# Altium schematic sheet commu.SchDoc
size A4
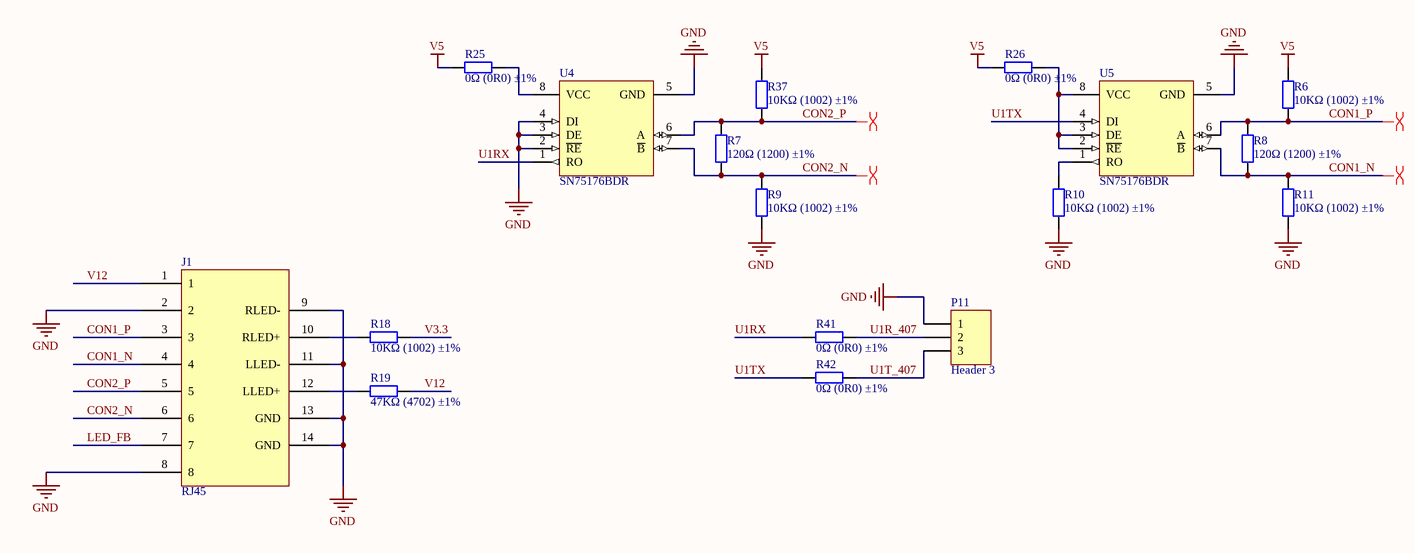
[diagram p0: commu.SchDoc]

## Parts
J1  RJ45  [RJ45_1]
P11  Header 3  [HDR1X3]
R6  10KΩ (1002) ±1%  [0603_R]
R7  120Ω (1200) ±1%  [0603_R]
R8  120Ω (1200) ±1%  [0603_R]
R9  10KΩ (1002) ±1%  [0603_R]
R10  10KΩ (1002) ±1%  [0603_R]
R11  10KΩ (1002) ±1%  [0603_R]
R18  10KΩ (1002) ±1%  [0603_R]
R19  47KΩ (4702) ±1%  [0603_R]
R25  0Ω (0R0) ±1%  [1206_R]
R26  0Ω (0R0) ±1%  [1206_R]
R37  10KΩ (1002) ±1%  [0603_R]
R41  0Ω (0R0) ±1%  [0603_R]
R42  0Ω (0R0) ±1%  [0603_R]
U4  SN75176BDR  [SOIC-8_150mil]
U5  SN75176BDR  [SOIC-8_150mil]

## Nets
GND: J1.2 J1.8 J1.9(RLED-) J1.11(LLED-) J1.13(GND) J1.14(GND) P11.1 R9.1 R10.1 R11.1 U4.2(~{RE}) U4.3(DE) U4.4(DI) U4.5(GND) U5.5(GND)
V5: R6.2 R25.1 R26.1 R37.2
CON1_N: J1.4 R8.1 R11.2 U5.7(~{B})
CON1_P: J1.3 R6.1 R8.2 U5.6(A)
CON2_N: J1.6 R7.1 R9.2 U4.7(~{B})
CON2_P: J1.5 R7.2 R37.1 U4.6(A)
LED_FB: J1.7
U1R_407: P11.2 R41.2
U1RX: R41.1 U4.1(RO)
U1T_407: P11.3 R42.2
U1TX: R42.1 U5.4(DI)
V3.3: R18.2
V12: J1.1 R19.2
NetJ1_10: J1.10(RLED+) R18.1
NetJ1_12: J1.12(LLED+) R19.1
NetR10_2: R10.2 U5.1(RO)
NetR25_2: R25.2 U4.8(VCC)
NetR26_2: R26.2 U5.2(~{RE}) U5.3(DE) U5.8(VCC)

## Layout directives
differential pair: CON1_N, CON1_P, CON2_N, CON2_P

## Library data of the parts
J1 = RJ45_1
P11 = Header 3: Header, 3-Pin; LatestRevisionDate: 17-Jul-2002; LatestRevisionNote: Re-released for DXP Platform.; Publisher: Altium Limited
R6 R9-R11 R18 R37 = 0603 10KΩ (1002) 1%: 贴片电阻; ComponentLink1Description: 供应商链接; ComponentLink1URL: http://www.szlcsc.com/product/details_26547.html; Package: 0603; Supplier: LC; SuppliersPartNumber: C25804
R7 R8 = 0603 120Ω (1200) 1%: 贴片电阻; ComponentLink1Description: 供应商链接; ComponentLink1URL: http://www.szlcsc.com/product/details_23514.html; Package: 0603; Supplier: LC; SuppliersPartNumber: C22787
R19 = 0603 47KΩ (4702) 1%: 贴片电阻; ComponentLink1Description: 供应商链接; ComponentLink1URL: http://www.szlcsc.com/product/details_26562.html; Package: 0603; Supplier: LC; SuppliersPartNumber: C25819
R25 R26 = 1206 0Ω (0R0) 1%: 贴片电阻; ComponentLink1Description: 供应商链接; ComponentLink1URL: http://www.szlcsc.com/product/details_18576.html; Package: 1206; Supplier: LC; SuppliersPartNumber: C17888
R41 R42 = 0603 0Ω (0R0) 1%: 贴片电阻; ComponentLink1Description: 供应商链接; ComponentLink1URL: http://www.szlcsc.com/product/details_21903.html; Package: 0603; Supplier: LC; SuppliersPartNumber: C21189
U4 U5 = SN75176BDR_[C7063]: RS-485/RS-422; ComponentLink1Description: 供应商链接; ComponentLink1URL: http://www.szlcsc.com/product/details_7535.html; Package: SOIC-8_150mil; Supplier: LC; SuppliersPartNumber: C7063